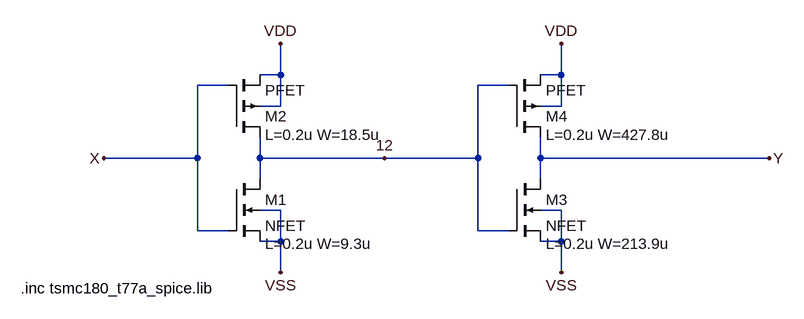
[diagram p0: schematic BUF.asc]
BUF.asc, the LTspice schematic file:
Version 4
SHEET 1 1496 680
WIRE 672 -16 672 -64
WIRE 672 -16 640 -16
WIRE 1104 -16 1104 -64
WIRE 1104 -16 1072 -16
WIRE 592 0 544 0
WIRE 1024 0 976 0
WIRE 672 32 672 -16
WIRE 672 32 640 32
WIRE 1104 32 1104 -16
WIRE 1104 32 1072 32
WIRE 544 112 544 0
WIRE 544 112 400 112
WIRE 640 112 640 80
WIRE 832 112 640 112
WIRE 976 112 976 0
WIRE 976 112 832 112
WIRE 1072 112 1072 80
WIRE 1424 112 1072 112
WIRE 640 144 640 112
WIRE 1072 144 1072 112
WIRE 672 192 640 192
WIRE 1104 192 1072 192
WIRE 544 224 544 112
WIRE 592 224 544 224
WIRE 976 224 976 112
WIRE 1024 224 976 224
WIRE 672 240 672 192
WIRE 672 240 640 240
WIRE 1104 240 1104 192
WIRE 1104 240 1072 240
WIRE 672 288 672 240
WIRE 1104 288 1104 240
FLAG 1424 112 Y
FLAG 400 112 X
FLAG 672 -64 VDD
FLAG 1104 -64 VDD
FLAG 672 288 VSS
FLAG 1104 288 VSS
FLAG 832 112 12
SYMBOL nmos4 592 144 R0
WINDOW 123 56 100 Left 2
SYMATTR Value2 L=0.2u W=9.3u
SYMATTR InstName M1
SYMATTR Value NFET
SYMBOL pmos4 592 80 M180
WINDOW 123 56 4 Left 2
SYMATTR Value2 L=0.2u W=18.5u
SYMATTR InstName M2
SYMATTR Value PFET
SYMBOL nmos4 1024 144 R0
WINDOW 123 56 100 Left 2
SYMATTR Value2 L=0.2u W=213.9u
SYMATTR InstName M3
SYMATTR Value NFET
SYMBOL pmos4 1024 80 M180
WINDOW 123 56 4 Left 2
SYMATTR Value2 L=0.2u W=427.8u
SYMATTR InstName M4
SYMATTR Value PFET
TEXT 272 312 Left 2 !.inc tsmc180_t77a_spice.lib

The netlist it stands for:
* BUF.asc
M1 12 X VSS VSS NFET L=0.2u W=9.3u
M2 12 X VDD VDD PFET L=0.2u W=18.5u
M3 Y 12 VSS VSS NFET L=0.2u W=213.9u
M4 Y 12 VDD VDD PFET L=0.2u W=427.8u
.model NMOS NMOS
.model PMOS PMOS
.lib standard.mos
.inc tsmc180_t77a_spice.lib
.backanno
.end